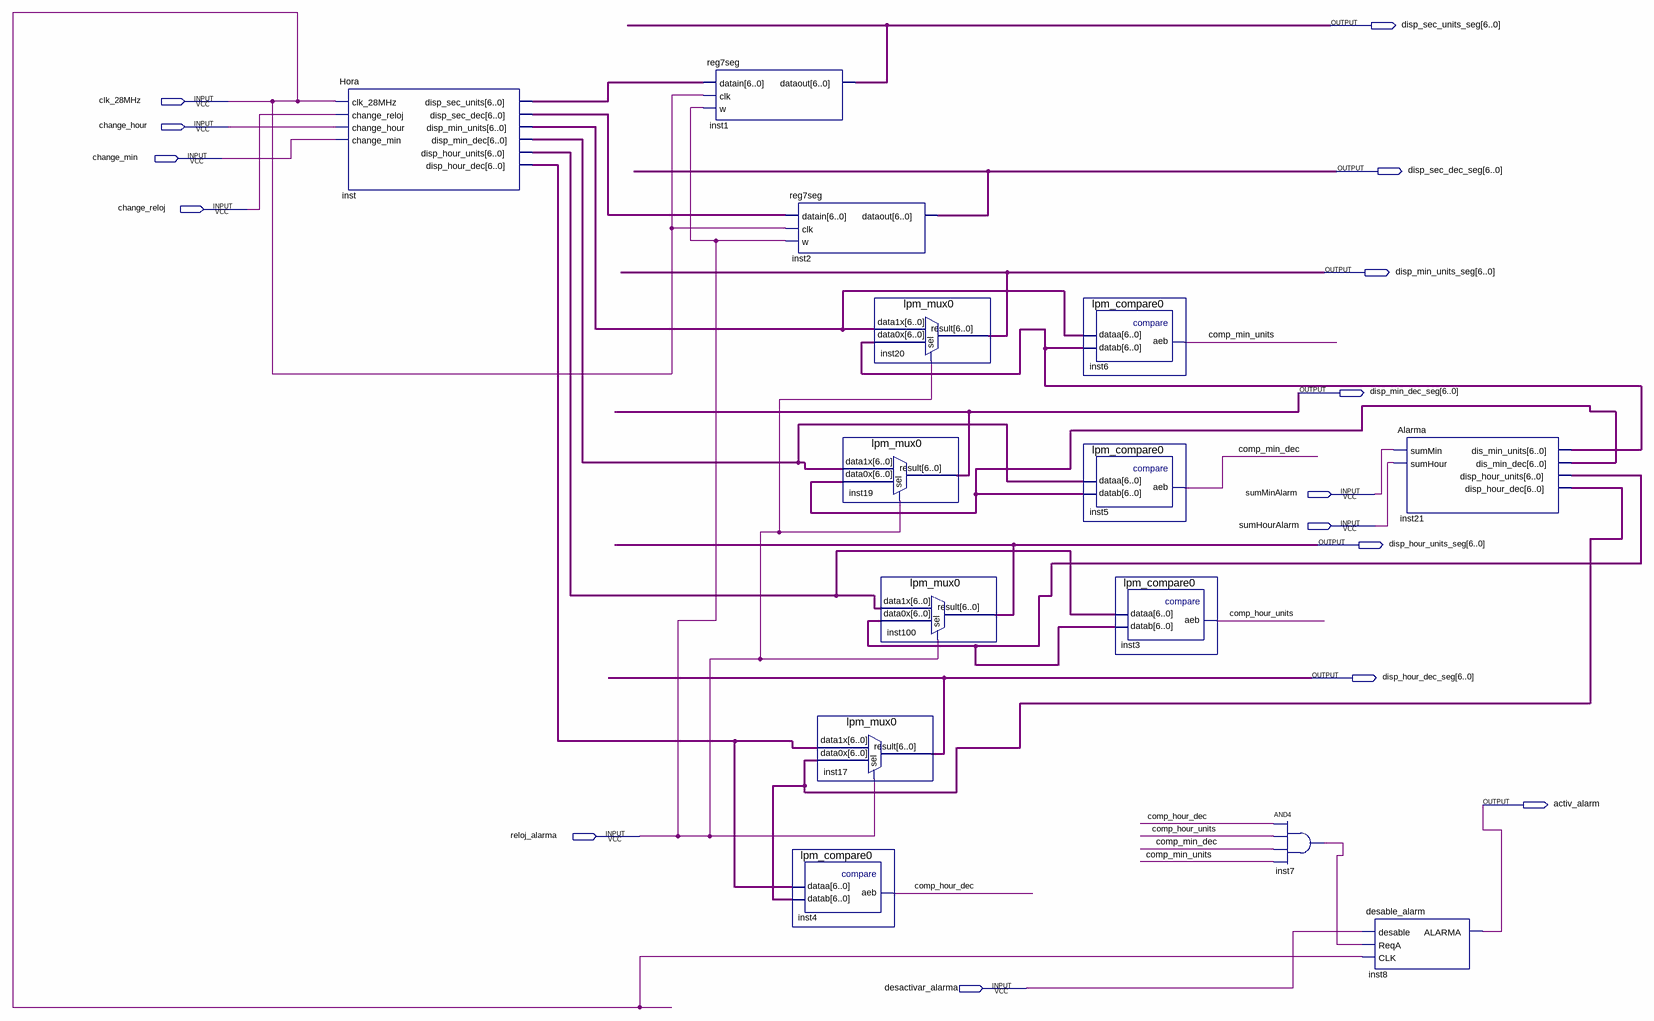
[diagram p0: schematic sheet]
// Quartus schematic labII.bdf as structural Verilog: 14 symbols, 15 pins
module labII (
  input  clk_28MHz,
  input  change_hour,
  input  change_min,
  input  change_reloj,
  input  sumMinAlarm,
  input  sumHourAlarm,
  input  reloj_alarma,
  input  desactivar_alarma,
  output [6:0] disp_sec_units_seg,
  output [6:0] disp_sec_dec_seg,
  output [6:0] disp_min_units_seg,
  output [6:0] disp_min_dec_seg,
  output [6:0] disp_hour_units_seg,
  output [6:0] disp_hour_dec_seg,
  output activ_alarm
);

  wire comp_hour_dec, comp_hour_units, comp_min_dec, comp_min_units, inst7_out;
  wire [6:0] inst21_dis_min_dec, inst21_dis_min_units, inst21_disp_hour_dec, inst21_disp_hour_units,
       inst_disp_hour_dec, inst_disp_hour_units, inst_disp_min_dec, inst_disp_min_units, inst_disp_sec_dec,
       inst_disp_sec_units;

  Hora inst (
    .clk_28MHz(clk_28MHz), .change_reloj(change_reloj), .change_hour(change_hour), .change_min(change_min),
    .disp_sec_units(inst_disp_sec_units), .disp_sec_dec(inst_disp_sec_dec),
    .disp_min_units(inst_disp_min_units), .disp_min_dec(inst_disp_min_dec),
    .disp_hour_units(inst_disp_hour_units), .disp_hour_dec(inst_disp_hour_dec));
  reg7seg inst1 (.datain(inst_disp_sec_units), .clk(clk_28MHz), .w(reloj_alarma), .dataout(disp_sec_units_seg));
  reg7seg inst2 (.datain(inst_disp_sec_dec), .clk(clk_28MHz), .w(reloj_alarma), .dataout(disp_sec_dec_seg));
  lpm_mux0 inst17 (
    .data1x(inst_disp_hour_dec), .data0x(inst21_disp_hour_dec), .sel(reloj_alarma), .result(disp_hour_dec_seg));
  lpm_compare0 inst4 (.dataa(inst_disp_hour_dec), .datab(inst21_disp_hour_dec), .aeb(comp_hour_dec));
  lpm_mux0 inst20 (
    .data1x(inst_disp_min_units), .data0x(inst21_dis_min_units), .sel(reloj_alarma),
    .result(disp_min_units_seg));
  lpm_mux0 inst19 (
    .data1x(inst_disp_min_dec), .data0x(inst21_dis_min_dec), .sel(reloj_alarma), .result(disp_min_dec_seg));
  lpm_mux0 inst100 (
    .data1x(inst_disp_hour_units), .data0x(inst21_disp_hour_units), .sel(reloj_alarma),
    .result(disp_hour_units_seg));
  lpm_compare0 inst6 (.dataa(inst_disp_min_units), .datab(inst21_dis_min_units), .aeb(comp_min_units));
  lpm_compare0 inst5 (.dataa(inst_disp_min_dec), .datab(inst21_dis_min_dec), .aeb(comp_min_dec));
  lpm_compare0 inst3 (.dataa(inst_disp_hour_units), .datab(inst21_disp_hour_units), .aeb(comp_hour_units));
  and inst7 (inst7_out, comp_hour_dec, comp_hour_units, comp_min_dec, comp_min_units);
  desable_alarm inst8 (.desable(desactivar_alarma), .ReqA(inst7_out), .CLK(clk_28MHz), .ALARMA(activ_alarm));
  Alarma inst21 (
    .sumMin(sumMinAlarm), .sumHour(sumHourAlarm), .dis_min_units(inst21_dis_min_units),
    .dis_min_dec(inst21_dis_min_dec), .disp_hour_units(inst21_disp_hour_units),
    .disp_hour_dec(inst21_disp_hour_dec));
endmodule
